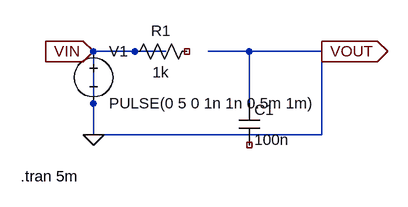
[diagram p0: schematic rc_passe_bas.asc]
rc_passe_bas.asc, the LTspice schematic file:
Version 4
SHEET 1 880 680
WIRE 192 128 80 128
WIRE 320 128 256 128
WIRE 320 128 320 208
WIRE 432 128 320 128
WIRE 80 128 80 256
WIRE 432 256 432 128
WIRE 80 256 432 256
FLAG 80 256 0
FLAG 80 128 VIN
FLAG 432 128 VOUT
IOPIN 80 128 In
IOPIN 432 128 Out
SYMBOL res 240 112 R90
WINDOW 0 0 56 VBottom 2
WINDOW 3 32 56 VTop 2
SYMATTR InstName R1
SYMATTR Value 1k
SYMBOL cap 304 208 R0
WINDOW 0 24 10 Left 2
WINDOW 3 24 56 Left 2
SYMATTR InstName C1
SYMATTR Value 100n
SYMBOL voltage 80 112 R0
WINDOW 123 0 0 Left 0
WINDOW 39 0 0 Left 0
SYMATTR InstName V1
SYMATTR Value PULSE(0 5 0 1n 1n 0.5m 1m)
TEXT -32 320 Left 2 !.tran 5m

The netlist it stands for:
* rc_passe_bas.asc
R1 NC_01 0 1k
C1 0 NC_02 100n
V1 0 0 PULSE(0 5 0 1n 1n 0.5m 1m)
.tran 5m
.backanno
.end